# Altium schematic sheet JadePlus_v0.3.1_schematics_PG2_PMS.SchDoc
size A3; SheetNumber: 2; SheetTotal: 3
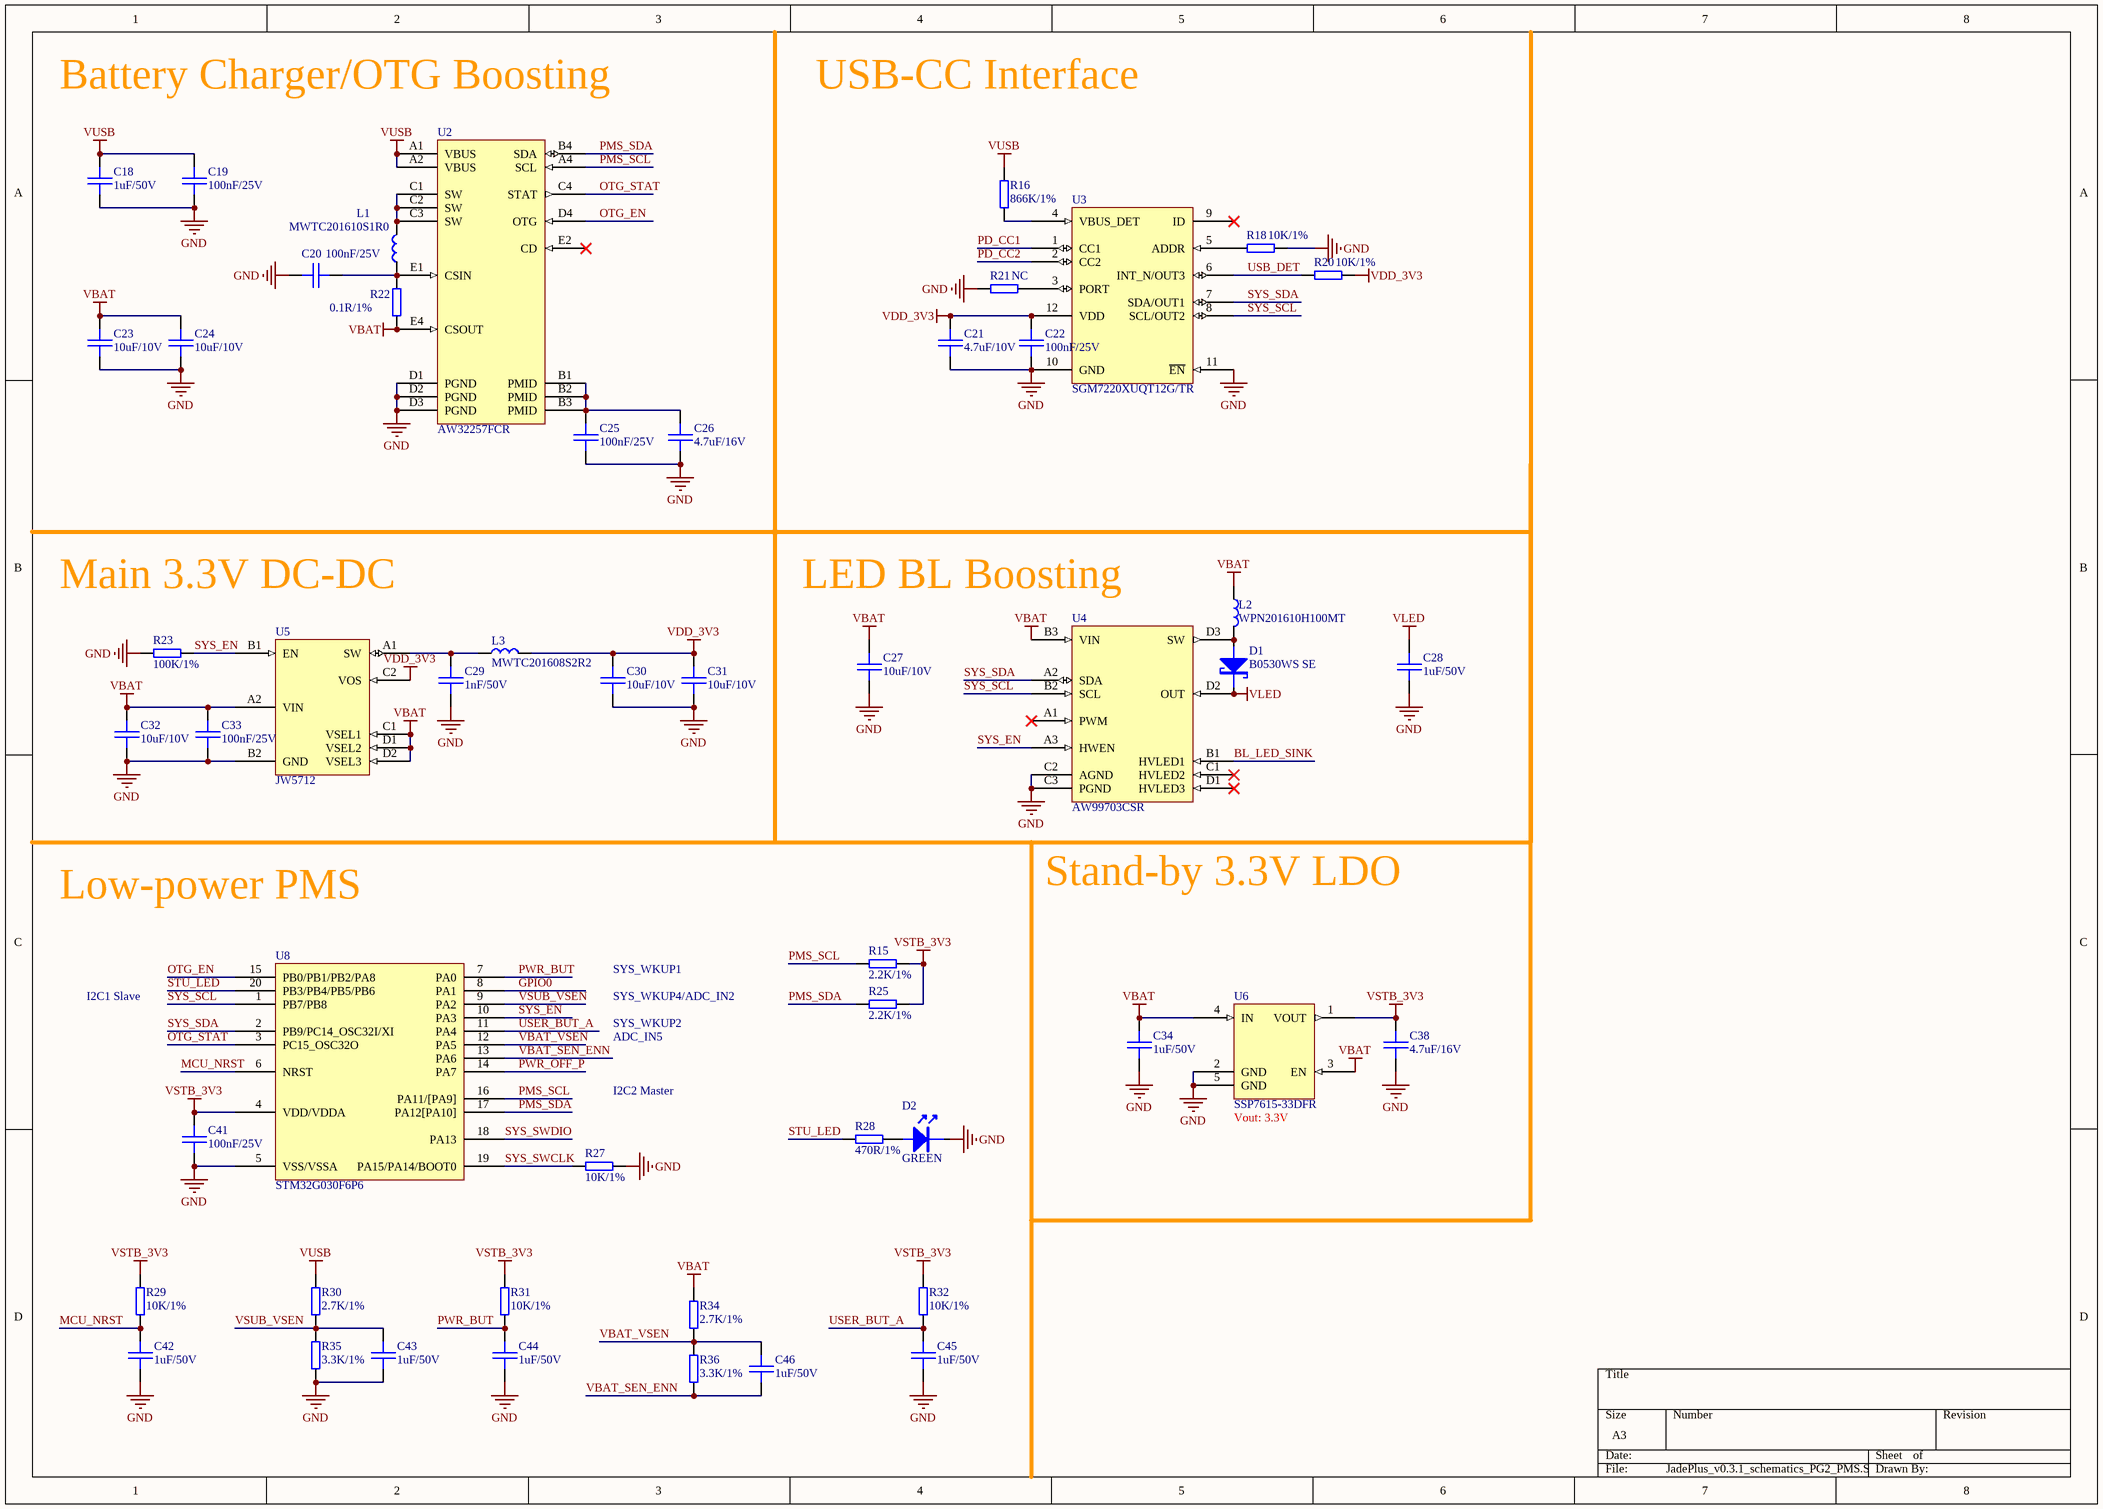
[diagram p0: JadePlus_v0.3.1_schematics_PG2_PMS.SchDoc]

## Parts
C18  1uF/50V  [C0402-L-HD]
C19  100nF/25V  [C0201-HD]
C20  100nF/25V  [C0402-HD]
C21  4.7uF/10V  [C0402-L-HD]
C22  100nF/25V  [C0201-HD]
C23  10uF/10V  [C0402-L-HD]
C24  10uF/10V  [C0402-L-HD]
C25  100nF/25V  [C0201-HD]
C26  4.7uF/16V  [C0402-L-HD]
C27  10uF/10V  [C0402-L-HD]
C28  1uF/50V  [C0402-L-HD]
C29  1nF/50V  [C0201-HD]
C30  10uF/10V  [C0402-L-HD]
C31  10uF/10V  [C0402-L-HD]
C32  10uF/10V  [C0402-L-HD]
C33  100nF/25V  [C0201-HD]
C34  1uF/50V  [C0402-L-HD]
C38  4.7uF/16V  [C0402-L-HD]
C41  100nF/25V  [C0201-HD]
C42  1uF/50V  [C0402-L-HD]
C43  1uF/50V  [C0402-L-HD]
C44  1uF/50V  [C0402-L-HD]
C45  1uF/50V  [C0402-L-HD]
C46  1uF/50V  [C0402-L-HD]
D1  B0530WS SE  [SMT_DIODE_SOD_323]
D2  GREEN  [SMT_LED_0603]
L1  MWTC201610S1R0  [MWTC201610-HD]
L2  WPN201610H100MT  [MWTC201610-HD]
L3  MWTC201608S2R2  [MWTC201610-HD]
R15  2.2K/1%  [R0402-HD]
R16  866K/1%  [R0402-HD]
R18  10K/1%  [R0402-HD]
R20  10K/1%  [R0402-HD]
R21  NC  [R0402-HD]
R22  0.1R/1%  [R0603-HD]
R23  100K/1%  [R0402-HD]
R25  2.2K/1%  [R0402-HD]
R27  10K/1%  [R0402-HD]
R28  470R/1%  [R0402-HD]
R29  10K/1%  [R0402-HD]
R30  2.7K/1%  [R0402-HD]
R31  10K/1%  [R0402-HD]
R32  10K/1%  [R0402-HD]
R34  2.7K/1%  [R0402-HD]
R35  3.3K/1%  [R0402-HD]
R36  3.3K/1%  [R0402-HD]
U2  AW32257FCR  [BGA20C40P4X5_200X200X60]
U3  SGM7220XUQT12G/TR  [QFN40P160X160X60-12L]
U4  AW99703CSR  [BGA12C40P3X4_124X164X64]
U5  JW5712  [BGA8C40P2X4_86X156X60]
U6  SSP7615-33DFR  [X2SON4]
U8  STM32G030F6P6  [TSOP-20-HD]

## Nets
GND: C18.1 C19.1 C20.2 C21.1 C22.1 C23.1 C24.1 C25.1 C26.1 C27.1 C28.1 C29.1 C30.1 C31.1 C32.1 C33.1 C34.1 C38.1 C41.1 C42.1 C43.1 C44.1 C45.1 D2.2(K) R18.2 R21.1 R23.1 R27.1 R35.2 U2.D1(PGND) U2.D2(PGND) U2.D3(PGND) U3.10(GND) U3.11(~{EN}) U4.C2(AGND) U4.C3(PGND) U5.B2(GND) U6.2(GND) U6.5(GND) U8.5(VSS/VSSA)
VBAT: C23.2 C24.2 C27.2 C32.2 C33.2 C34.2 L2.1 R22.1 R34.1 U2.E4(CSOUT) U4.B3(VIN) U5.A2(VIN) U5.C1(VSEL1) U5.D1(VSEL2) U5.D2(VSEL3) U6.3(EN) U6.4(IN)
VDD_3V3: C21.2 C22.2 C30.2 C31.2 L3.1 R20.2 U3.12(VDD) U5.C2(VOS)
VLED: C28.2 D1.2(K) U4.D2(OUT)
VSTB_3V3: C38.2 C41.2 R15.2 R25.2 R29.1 R31.1 R32.1 U6.1(VOUT) U8.4(VDD/VDDA)
VUSB: C18.2 C19.2 R16.1 R30.1 U2.A1(VBUS) U2.A2(VBUS)
BL_LED_SINK: U4.B1(HVLED1)
GPIO0: U8.8(PA1)
MCU_NRST: C42.2 R29.2 U8.6(NRST)
OTG_EN: U2.D4(OTG) U8.15(PB0/PB1/PB2/PA8)
OTG_STAT: U2.C4(STAT) U8.3(PC15_OSC32O)
PD_CC1: U3.1(CC1)
PD_CC2: U3.2(CC2)
PMS_SCL: R15.1 U2.A4(SCL) U8.16(PA11/[PA9])
PMS_SDA: R25.1 U2.B4(SDA) U8.17(PA12[PA10])
PWR_BUT: C44.2 R31.2 U8.7(PA0)
PWR_OFF_P: U8.14(PA7)
STU_LED: R28.2 U8.20(PB3/PB4/PB5/PB6)
SYS_EN: R23.2 U4.A3(HWEN) U5.B1(EN) U8.10(PA3)
SYS_SCL: U3.8(SCL/OUT2) U4.B2(SCL) U8.1(PB7/PB8)
SYS_SDA: U3.7(SDA/OUT1) U4.A2(SDA) U8.2(PB9/PC14_OSC32I/XI)
SYS_SWCLK: R27.2 U8.19(PA15/PA14/BOOT0)
SYS_SWDIO: U8.18(PA13)
USB_DET: R20.1 U3.6(INT_N/OUT3)
USER_BUT_A: C45.2 R32.2 U8.11(PA4)
VBAT_SEN_ENN: C46.1 R36.2 U8.13(PA6)
VBAT_VSEN: C46.2 R34.2 R36.1 U8.12(PA5)
VSUB_VSEN: C43.2 R30.2 R35.1 U8.9(PA2)
NetC20_1: C20.1 L1.2 R22.2 U2.E1(CSIN)
NetC25_2: C25.2 C26.2 U2.B1(PMID) U2.B2(PMID) U2.B3(PMID)
NetC29_2: C29.2 L3.2 U5.A1(SW)
NetD1_1: D1.1(A) L2.2 U4.D3(SW)
NetD2_1: D2.1(A) R28.1
NetL1_1: L1.1 U2.C1(SW) U2.C2(SW) U2.C3(SW)
NetR16_2: R16.2 U3.4(VBUS_DET)
NetR18_1: R18.1 U3.5(ADDR)
NetR21_2: R21.2 U3.3(PORT)

Not connected (* = marked no-connect by the designer): U2 E2(CD)*; U3 9(ID)*; U4 A1(PWM)* C1(HVLED2)* D1(HVLED3)*

## Notes on the sheet
- Battery Charger/OTG Boosting
- USB-CC Interface
- Main 3.3V DC-DC
- LED BL Boosting
- Low-power PMS
- Stand-by 3.3V LDO
- SYS_WKUP1
- I2C1 Slave
- SYS_WKUP4/ADC_IN2
- SYS_WKUP2
- ADC_IN5
- I2C2 Master
- (near U6) Vout: 3.3V

## Library data of the parts
C18-C34 C38 C41-C46 = SMT_C_0402: Surface mount capacitor 0402
D1 = SMT_DIODE_SCHOTTKY_SOD_323: Surface mount schottky diode SOD-323(0805) Package / C22626
D2 = SMT_LED_0603: Surface mount LED 0603
L1-L3 = SMT_L_0805: Surface mount inductor 0805
R15 R16 R18 R20 R21 R23 R25 R27-R32 R34-R36 = SMT_R_0402: Surface mount resistor 0402
R22 = SMT_R_0603: Surface mount resistor 0603
U2 = AW32257
U3 = SGM7220: SGM7220XUQT12G/TR / TUSB320 / HUSB320_BA000-QN12R
U4 = AW99703
U6 = AP7343: 300mA HIGH PSRR LOW NOISE LDO WITH ENABLE